# EAGLE design badge_scienceTour (EAGLE 6.5.0)
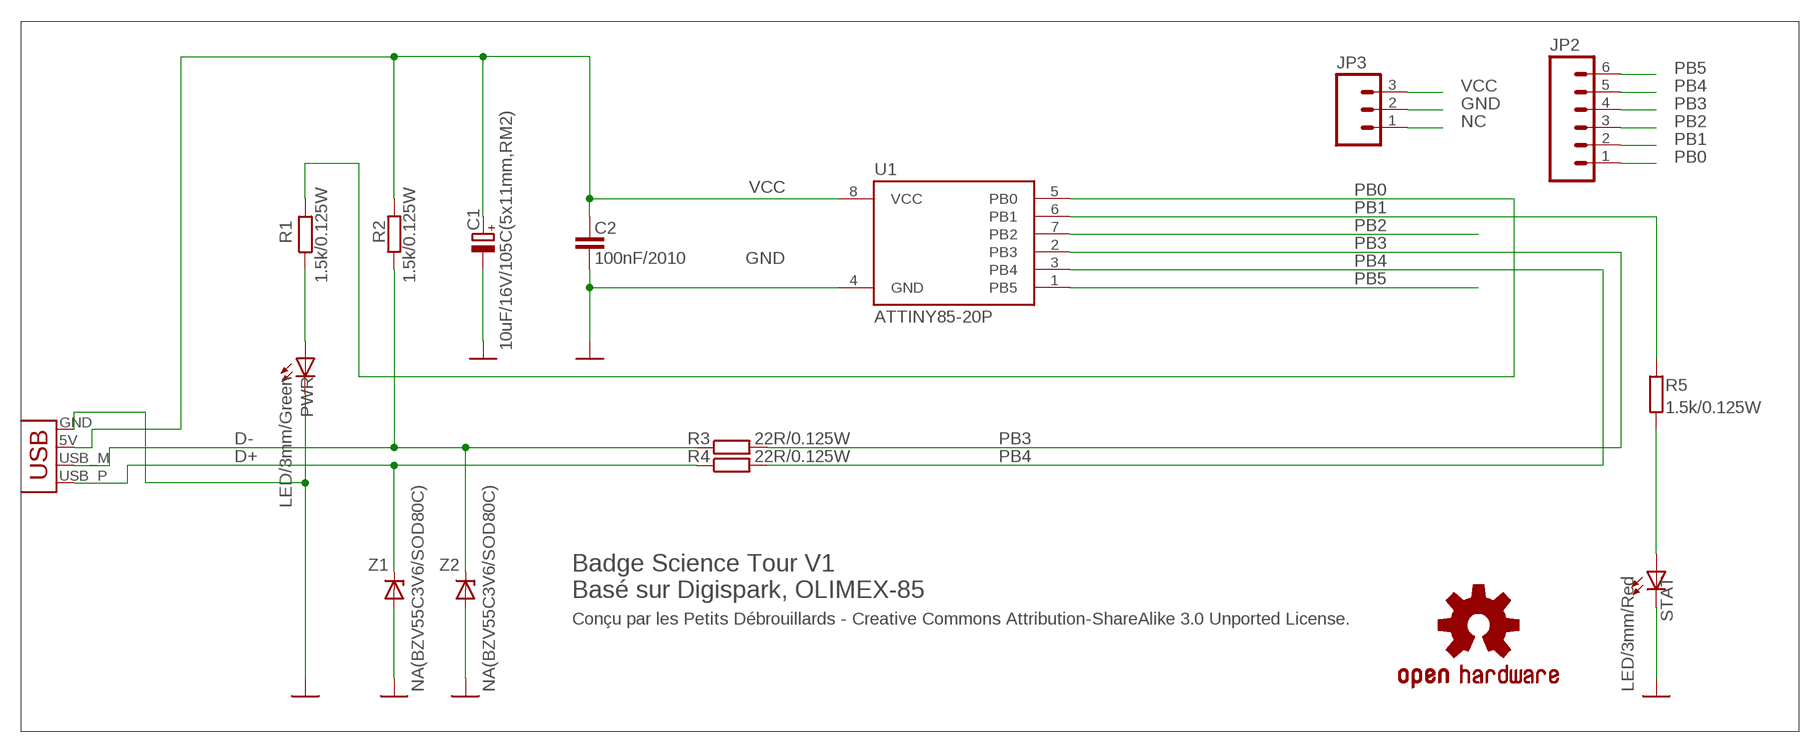
[diagram p0: schematic, sheet 1]

## Parts
C1  10uF/16V/105C(5x11mm,RM2)  CPOL-EUE2-5  [E2-5]
C2  100nF/2010  C-EU025-025X050  [C025-025X050]
JP1  USBPCB  [USB-A-PCB]
JP2  M06NO_SILK  [1X06_NO_SILK]
JP3  M031X03_NO_SILK  [1X03_NO_SILK]
LOGO1  OSHW-LOGOS  [OSHW-LOGO-S]
PWR  LED/3mm/Green  LED3MM  [LED3MM]
R1  1.5k/0.125W  R-EU_0204/5  [0204/5]
R2  1.5k/0.125W  R-EU_0204/5  [0204/5]
R3  22R/0.125W  R-EU_0204/5  [0204/5]
R4  22R/0.125W  R-EU_0204/5  [0204/5]
R5  1.5k/0.125W  R-EU_0204/5  [0204/5]
STAT  LED/3mm/Red  LED3MM  [LED3MM]
U1  ATTINY85-20P  [PDIP08_300MIL]
Z1  NA(BZV55C3V6/SOD80C)  ZENER-DIODEZD-5  [ZDIO-5]
Z2  NA(BZV55C3V6/SOD80C)  ZENER-DIODEZD-5  [ZDIO-5]

## Nets
D+: JP1.USB_P(D+) R4.1 Z1.C
D-: JP1.USB_M(D-) R2.1 R3.1 Z2.C
GND [PWR]: C1.- C2.2 JP1.GND JP3.2 PWR.K(C) STAT.K(C) U1.4(GND) Z1.A Z2.A
N$1: PWR.A R1.1
N$4: R5.1 STAT.A
NC: JP3.1
PB0: JP2.1 R1.2 U1.5(PB0)
PB1: JP2.2 R5.2 U1.6(PB1)
PB2: JP2.3 U1.7(PB2)
PB3: JP2.4 R3.2 U1.2(PB3)
PB4: JP2.5 R4.2 U1.3(PB4)
PB5: JP2.6 U1.1(PB5)
VCC [PWR]: C1.+ C2.1 JP1.5V(VBUS) JP3.3 R2.2 U1.8(VCC)

## Notes on the sheet
- Badge Science Tour V1
  Basé sur Digispark, OLIMEX-85
- Conçu par les Petits Débrouillards - Creative Commons Attribution-ShareAlike 3.0 Unported License.

## Library data of the parts
C1 = rcl:CPOL-EU: POLARIZED CAPACITOR, European symbol
C2 = rcl:C-EU: CAPACITOR, European symbol
JP1 = SparkFun-Connectors:USB: USB Connectors USB-B-PTH is fully proven SKU : PRT-00139/CONN-08278 USB-miniB is fully proven SKU : PRT-00587 USB-A-PCB is untested. USB-A-H is throughly reviewed, but untested. Spark Fun Electronics SKU : PRT-00437 USB-B-SMT is throughly reviewed, but untested. Needs silkscreen touching up. USB-A-S has not been used/tested USB-MB-H has not been used/tested USB-MICROB has been used. CONN-09505
JP2 = SparkFun-Connectors:M06: Header 6 Standard 6-pin 0.1" header. Use with straight break away headers (SKU : PRT-00116), right angle break away headers (PRT-00553), swiss pins (PRT-00743), machine pins (PRT-00117), and female headers (PRT-00115). Molex polarized connector foot print use with SKU : PRT-08094 with associated crimp pins and housings. NOTES ON THE VARIANTS LOCK and LOCK_LONGPADS... This footprint was designed to help hold the alignment of a through-hole component (i.e. 6-pin header) while soldering it into place. You may notice that each hole has been shifted either up or down by 0.005 of an inch from it's more standard position (which is a perfectly straight line). This slight alteration caused the pins (the squares in the middle) to touch the edges of the holes. Because they are alternating, it causes a "brace" to hold the component in place. 0.005 has proven to be the perfect amount of "off-center" position when using our standard breakaway headers. Although looks a little odd when you look at the bare footprint, once you have a header in there, the alteration is very hard to notice. Also,if you push a header all the way into place, it is covered up entirely on the bottom side. This idea of altering the position of holes to aid alignment will be further integrated into the Sparkfun Library for other footprints. It can help hold any component with 3 or more connection pins.
JP3 = SparkFun-Connectors:M03: Header 3 Standard 3-pin 0.1" header. Use with straight break away headers (SKU : PRT-00116), right angle break away headers (PRT-00553), swiss pins (PRT-00743), machine pins (PRT-00117), and female headers (PRT-00115). Molex polarized connector foot print use with SKU : PRT-08232 with associated crimp pins and housings.
LOGO1 = SparkFun-Aesthetics:OSHW-LOGO: Open Source Hardware Logo This logo indicates the piece of hardware it is found on incorporates a OSHW license and/or adheres to the definition of open source hardware found here: http://freedomdefined.org/OSHW
PWR STAT = led:LED: LED OSRAM: - CHIPLED LG R971, LG N971, LY N971, LG Q971, LY Q971, LO R971, LY R971 LH N974, LH R974 LS Q976, LO Q976, LY Q976 LO Q996 - Hyper CHIPLED LW Q18S LB Q993, LB Q99A, LB R99A - SideLED LS A670, LO A670, LY A670, LG A670, LP A670 LB A673, LV A673, LT A673, LW A673 LH A674 LY A675 LS A676, LA A676, LO A676, LY A676, LW A676 LS A679, LY A679, LG A679 - Hyper Micro SIDELED® LS Y876, LA Y876, LO Y876, LY Y876 LT Y87S - SmartLED LW L88C, LW L88S LB L89C, LB L89S, LG L890 LS L89K, LO L89K, LY L89K LS L896, LA L896, LO L896, LY L896 - TOPLED LS T670, LO T670, LY T670, LG T670, LP T670 LSG T670, LSP T670, LSY T670, LOP T670, LYG T670 LG T671, LOG T671, LSG T671 LB T673, LV T673, LT T673, LW T673 LH T674 LS T676, LA T676, LO T676, LY T676, LB T676, LH T676, LSB T676, LW T676 LB T67C, LV T67C, LT T67C, LS T67K, LO T67K, LY T67K, LW E67C LS E67B, LA E67B, LO E67B, LY E67B, LB E67C, LV E67C, LT E67C LW T67C LS T679, LY T679, LG T679 LS T770, LO T770, LY T770, LG T770, LP T770 LB T773, LV T773, LT T773, LW T773 LH T774 LS E675, LA E675, LY E675, LS T675 LS T776, LA T776, LO T776, LY T776, LB T776 LHGB T686 LT T68C, LB T68C - Hyper Mini TOPLED® LB M676 - Mini TOPLED Santana® LG M470 LS M47K, LO M47K, LY M47K Source: http://www.osram.convergy.de LUXEON: - LUMILED® LXK2-PW12-R00, LXK2-PW12-S00, LXK2-PW14-U00, LXK2-PW14-V00 LXK2-PM12-R00, LXK2-PM12-S00, LXK2-PM14-U00 LXK2-PE12-Q00, LXK2-PE12-R00, LXK2-PE12-S00, LXK2-PE14-T00, LXK2-PE14-U00 LXK2-PB12-K00, LXK2-PB12-L00, LXK2-PB12-M00, LXK2-PB14-N00, LXK2-PB14-P00, LXK2-PB14-Q00 LXK2-PR12-L00, LXK2-PR12-M00, LXK2-PR14-Q00, LXK2-PR14-R00 LXK2-PD12-Q00, LXK2-PD12-R00, LXK2-PD12-S00 LXK2-PH12-R00, LXK2-PH12-S00 LXK2-PL12-P00, LXK2-PL12-Q00, LXK2-PL12-R00 Source: www.luxeon.com KINGBRIGHT: KA-3528ASYC Source: www.kingbright.com
R1-R5 = rcl:R-EU_: RESISTOR, European symbol
U1 = _hhn_attiny25_45_85:ATTINY85*: ATMEL ATtiny 85 Packages: P = PDIP 08 30mil S = SOIC 08 EIAJ 208mil Technologies Note: for complete ordering code (temp. range, finish, tape&reel etc.) see www.atmel.com • Supply Voltage: V = (1.8…5.5)V | [blank] = (2.7…5.5)V • Speed: 10 = 10 MHz | 20 = 20 MHz Author: Dipl.-Ing. FH Rainer Bayer HHN Hochschule Heilbronn (Heilbronn University), rainer.bayer@hs-heilbronn.de Ingenieurbüro ing-rb, mail@ing-rb.de
Z1 Z2 = diode:ZENER-DIODE: Z-Diode

## Net classes
1 PWR: width 0.5 mm

## Board
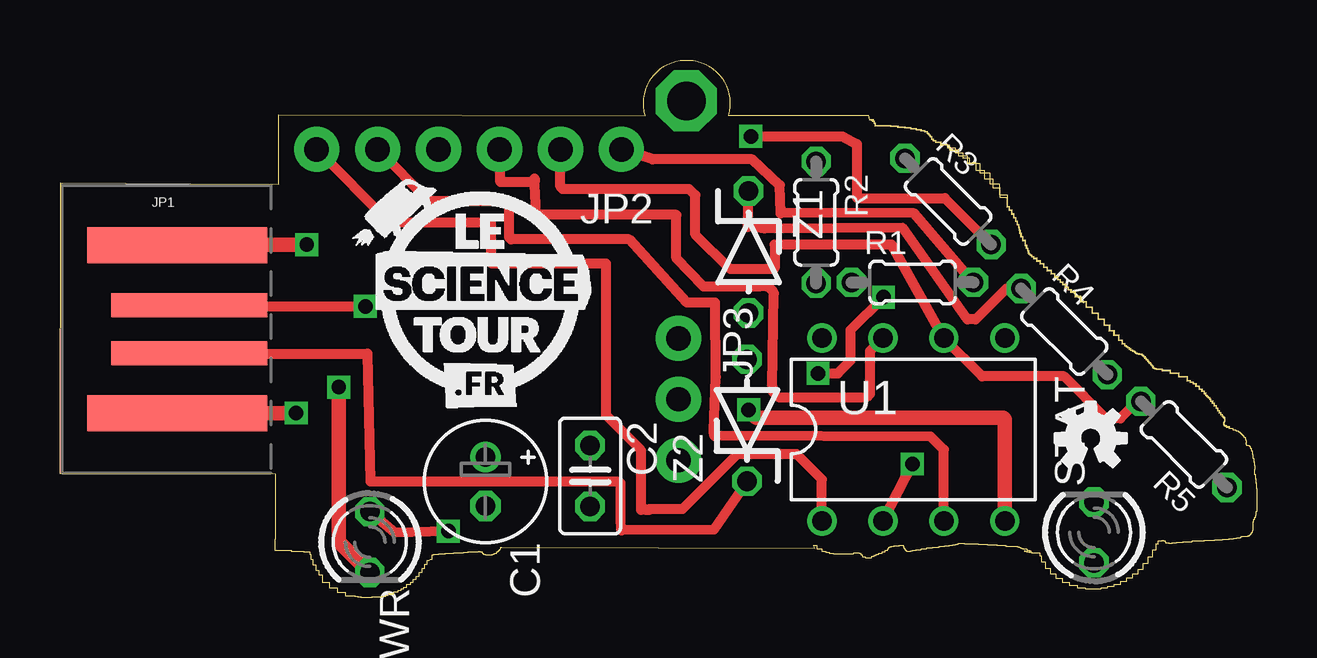
[diagram p1: board, top side]
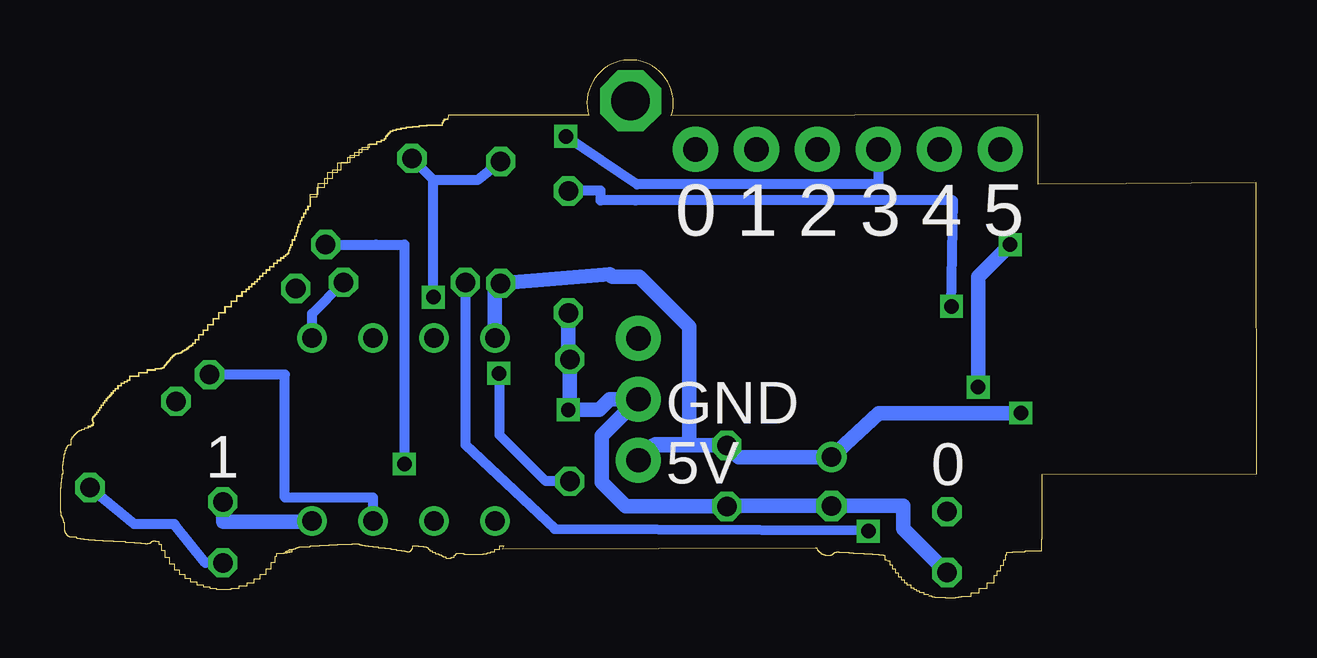
[diagram p2: board, bottom side, seen from below]

Size 49.87 x 22.4 mm. Coordinates in mm from the lower left corner, seen from the top.
Outline: 33.71,19.91 33.76,19.91 33.76,19.9 33.79,19.9 33.79,19.9 33.8,19.9 33.8,19.9 33.81,19.9 33.81,19.89 33.85,19.89 33.85,19.84 33.9,19.84 33.9,19.76 33.94,19.76 33.94,19.66 34.28,19.66 34.28,19.65 34.6,19.65 34.6,19.63 34.9,19.63 34.9,19.6 35.18,19.6 35.18,19.57 35.43,19.57 35.43,19.53 35.66,19.53 35.66,19.49 35.85,19.49 35.85,19.44 36.01,19.44 36.01,19.4 36.11,19.4 36.11,19.35 36.15,19.35 36.15,19.32 36.18,19.32 36.18,19.28 36.22,19.28 36.22,19.24 36.24,19.24 36.24,19.19 36.3,19.19 36.3,19.1 36.36,19.1 36.36,19.03 36.48,19.03 36.48,18.96 36.67,18.96 36.67,18.86 37.04,18.86 37.04,18.66 37.42,18.66 37.42,18.41 37.8,18.41 37.8,18.12 38.16,18.12 38.16,17.8 38.52,17.8 38.52,17.45 38.86,17.45 38.86,17.08 39.17,17.08 39.17,16.69 39.45,16.69 39.45,16.28 39.54,16.28 39.54,16.13 39.63,16.13 39.63,15.98 39.72,15.98 39.72,15.82 39.8,15.82 39.8,15.67 39.87,15.67 39.87,15.53 39.92,15.53 39.92,15.41 39.96,15.41 39.96,15.32 39.97,15.32 39.97,15.27 39.98,15.27 39.98,15.17 40.02,15.17 40.02,15.04 40.09,15.04 40.09,14.87 40.19,14.87 40.19,14.67 40.25,14.67 40.25,14.55 40.3,14.55 40.3,14.44 40.33,14.44 40.33,14.37 40.34,14.37 40.34,14.33 40.36,14.33 40.36,14.3 40.41,14.3 40.41,14.25 40.47,14.25 40.47,14.19 40.55,14.19 40.55,14.12 40.67,14.12 40.67,14.02 40.81,14.02 40.81,13.9 40.97,13.9 40.97,13.76 41.12,13.76 41.12,13.62 41.28,13.62 41.28,13.49 41.42,13.49 41.42,13.36 41.55,13.36 41.55,13.24 41.66,13.24 41.66,13.14 41.76,13.14 41.76,13.04 41.87,13.04 41.87,12.93 42,12.93 42,12.81 42.1,12.81 42.1,12.71 42.29,12.71 42.29,12.54 42.5,12.54 42.5,12.33 42.74,12.33 42.74,12.09 42.99,12.09 42.99,11.84 43.25,11.84 43.25,11.59 43.49,11.59 43.49,11.34 43.71,11.34 43.71,11.12 43.89,11.12 43.89,10.93 44.09,10.93 44.09,10.72 44.24,10.72 44.24,10.58 44.34,10.58 44.34,10.48 44.4,10.48 44.4,10.44 44.48,10.44 44.48,10.4 44.53,10.4 44.53,10.35 44.6,10.35 44.6,10.3 44.68,10.3 44.68,10.26 44.75,10.26 44.75,10.22 44.8,10.22 44.8,10.18 44.85,10.18 44.85,10.15 44.94,10.15 44.94,10.14 45,10.14 45,10.14 45.02,10.14 45.02,10.13 45.05,10.13 45.05,10.11 45.07,10.11 45.07,10.09 45.1,10.09 45.1,10.06 45.14,10.06 45.14,10.02 45.19,10.02 45.19,9.97 45.25,9.97 45.25,9.9 45.3,9.9 45.3,9.84 45.35,9.84 45.35,9.79 45.37,9.79 45.37,9.77 45.39,9.77 45.39,9.75 45.42,9.75 45.42,9.72 45.45,9.72 45.45,9.68 45.48,9.68 45.48,9.64 45.52,9.64 45.52,9.58 45.55,9.58 45.55,9.54 45.6,9.54 45.6,9.52 45.66,9.52 45.66,9.51 45.91,9.51 45.91,9.46 46.23,9.46 46.23,9.35 46.6,9.35 46.6,9.2 46.96,9.2 46.96,9.04 47.08,9.04 47.08,8.97 47.19,8.97 47.19,8.9 47.31,8.9 47.31,8.8 47.45,8.8 47.45,8.68 47.56,8.68 47.56,8.58 47.66,8.58 47.66,8.5 47.73,8.5 47.73,8.43 47.76,8.43 47.76,8.39 47.79,8.39 47.79,8.36 47.82,8.36 47.82,8.31 47.88,8.31 47.88,8.25 47.93,8.25 47.93,8.18 48,8.18 48,8.1 48.08,8.1 48.08,7.99 48.15,7.99 48.15,7.88 48.22,7.88 48.22,7.78 48.29,7.78 48.29,7.69 48.35,7.69 48.35,7.61 48.4,7.61 48.4,7.55 48.44,7.55 48.44,7.51 48.48,7.51 48.48,7.49 48.5,7.49 48.5,7.46 48.51,7.46 48.51,7.43 48.51,7.43 48.51,7.39 48.51,7.39 48.51,7.33 48.49,7.33 48.49,7.29 48.47,7.29 48.47,7.25 48.48,7.25 48.48,7.2 48.49,7.2 48.49,7.16 48.53,7.16 48.53,7.13 48.59,7.13 48.59,7.09 48.7,7.09 48.7,7.05 48.86,7.05 48.86,6.99 48.99,6.99 48.99,6.94 49.08,6.94 49.08,6.9 49.15,6.9 49.15,6.86 49.2,6.86 49.2,6.83 49.24,6.83 49.24,6.79 49.28,6.79 49.28,6.74 49.32,6.74 49.32,6.68 49.38,6.68 49.38,6.59 49.42,6.59 49.42,6.53 49.43,6.53 49.43,6.48 49.42,6.48 49.42,6.43 49.42,6.43 49.42,6.38 49.42,6.38 49.42,6.35 49.43,6.35 49.43,6.34 49.47,6.34 49.47,6.34 49.52,6.34 49.52,6.32 49.57,6.32 49.57,6.28 49.6,6.28 49.6,6.22 49.63,6.22 49.63,6.11 49.67,6.11 49.67,5.97 49.71,5.97 49.71,5.81 49.74,5.81 49.74,5.65 49.76,5.65 49.76,5.5 49.78,5.5 49.78,5.32 49.76,5.32 49.76,5.13 49.79,5.13 49.79,4.94 49.83,4.94 49.83,4.78 49.85,4.78 49.85,4.56 49.87,4.56 49.87,4.3 49.87,4.3 49.87,4.04 49.87,4.04 49.87,3.79 49.86,3.79 49.86,3.57 49.83,3.57 49.83,3.4 49.8,3.4 49.8,3.32 49.76,3.32 49.76,3.25 49.73,3.25 49.73,3.13 49.7,3.13 49.7,3 49.69,3 49.69,2.86 49.69,2.86 49.69,2.77 49.68,2.77 49.68,2.71 49.66,2.71 49.66,2.67 49.62,2.67 49.62,2.62 49.57,2.62 49.57,2.58 49.53,2.58 49.53,2.55 49.48,2.55 49.48,2.54 49.41,2.54 49.41,2.54 49.3,2.54 49.3,2.52 49.2,2.52 49.2,2.49 49.17,2.49 49.17,2.48 49.11,2.48 49.11,2.46 49.02,2.46 49.02,2.45 48.88,2.45 48.88,2.43 48.69,2.43 48.69,2.42 48.43,2.42 48.43,2.39 48.09,2.39 48.09,2.37 47.66,2.37 47.66,2.34 47.16,2.34 47.16,2.3 46.78,2.3 46.78,2.27 46.51,2.27 46.51,2.25 46.33,2.25 46.33,2.25 46.21,2.25 46.21,2.25 46.14,2.25 46.14,2.26 46.1,2.26 46.1,2.29 46.08,2.29 46.08,2.32 46.06,2.32 46.06,2.34 46.03,2.34 46.03,2.35 45.98,2.35 45.98,2.36 45.91,2.36 45.91,2.35 45.78,2.35 45.78,2.34 45.75,2.34 45.75,2.22 45.66,2.22 45.66,1.97 45.51,1.97 45.51,1.68 45.32,1.68 45.32,1.4 45.12,1.4 45.12,1.16 44.91,1.16 44.91,0.97 44.68,0.97 44.68,0.8 44.44,0.8 44.44,0.65 44.18,0.65 44.18,0.54 43.91,0.54 43.91,0.44 43.64,0.44 43.64,0.38 43.36,0.38 43.36,0.35 42.74,0.35 42.74,0.39 42.4,0.39 42.4,0.48 42.08,0.48 42.08,0.61 41.77,0.61 41.77,0.78 41.52,0.78 41.52,0.97 41.28,0.97 41.28,1.21 41.06,1.21 41.06,1.47 40.9,1.47 40.9,1.73 40.84,1.73 40.84,1.85 40.52,1.85 40.52,1.86 40.41,1.86 40.41,1.88 40.31,1.88 40.31,1.92 40.19,1.92 40.19,1.98 40.47,1.88 40.47,1.92 40.41,1.92 40.41,1.95 40.33,1.95 40.33,1.96 40.31,1.99 40.31,2 40.21,2 40.21,2.01 40.14,2.01 40.14,2.02 40.09,2.02 40.09,2.04 40.06,2.04 40.06,2.06 40.03,2.06 40.03,2.08 39.97,2.08 39.97,2.1 39.9,2.1 39.9,2.11 39.8,2.11 39.8,2.12 39.44,2.12 39.44,2.15 39.05,2.15 39.05,2.18 38.66,2.18 38.66,2.2 38.29,2.2 38.29,2.22 37.96,2.22 37.96,2.23 37.69,2.23 37.69,2.23 37.51,2.23 37.51,2.23 37.43,2.23 37.43,2.22 37.39,2.22 37.39,2.2 37.3,2.2 37.3,2.18 37.18,2.18 37.18,2.16 37.03,2.16 37.03,2.14 36.85,2.14 36.85,2.12 36.61,2.12 36.61,2.08 36.34,2.08 36.34,2.04 36.09,2.04 36.09,2.01 35.86,2.01 35.86,1.98 35.65,1.98 35.65,1.95 35.5,1.95 35.5,1.92 35.42,1.92 35.42,1.91 35.37,1.91 35.37,1.91 35.33,1.91 35.33,1.92 35.3,1.92 35.3,1.93 35.26,1.93 35.26,1.97 35.21,1.97 35.21,2.03 35.18,2.03 35.18,2.09 35.17,2.09 35.17,2.15 34.94,2.15 34.94,2.13 34.74,2.13 34.74,2.12 34.62,2.12 34.62,2.1 34.56,2.1 34.56,2.07 34.52,2.07 34.52,2.02 34.46,2.02 34.46,1.96 34.37,1.96 34.37,1.89 34.24,1.89 34.24,1.83 34.1,1.83 34.1,1.77 33.99,1.77 33.99,1.73 33.92,1.73 33.92,1.69 33.8,1.69 33.8,1.64 33.68,1.64 33.68,1.63 33.57,1.63 33.57,1.67 33.44,1.67 33.44,1.76 33.38,1.76 33.38,1.82 33.33,1.82 33.33,1.84 33.29,1.84 33.29,1.85 33.24,1.85 33.24,1.83 33.05,1.83 33.05,1.81 32.77,1.81 32.77,1.8 32.48,1.8 32.48,1.8 32.24,1.8 32.24,1.82 32.07,1.82 32.07,1.86 31.92,1.86 31.92,1.91 31.76,1.91 31.76,2.01 31.55,2.01 31.55,2.15 31.39,2.15 31.45,2.04 18.41,2.07 18.38,2.07 18.35,2.07 18.31,1.98 18.28,1.98 18.28,1.92 18.24,1.92 18.24,1.88 18.17,1.88 18.17,1.83 18.1,1.83 18.1,1.8 18.04,1.8 18.04,1.77 17.99,1.77 17.99,1.76 17.93,1.76 17.93,1.76 17.82,1.76 17.82,1.76 17.73,1.76 17.73,1.78 17.66,1.78 17.66,1.81 17.62,1.81 17.62,1.85 17.61,1.85 17.61,1.87 17.59,1.87 17.59,1.88 17.55,1.88 17.55,1.89 17.5,1.89 17.5,1.9 17.43,1.9 17.43,1.9 17.32,1.9 17.32,1.89 17.18,1.89 17.18,1.88 17,1.88 17,1.86 16.81,1.86 16.81,1.85 16.6,1.85 16.6,1.83 16.39,1.83 16.39,1.82 16.2,1.82 16.2,1.81 16.04,1.81 16.04,1.81 15.89,1.81 15.89,1.8 15.76,1.8 15.76,1.79 15.68,1.79 15.68,1.78 15.56,1.78 15.56,1.77 15.5,1.77 15.5,1.58 15.44,1.58 15.37,1.52 15.29,1.52 15.29,1.36 15.19,1.36 15.19,1.2 15.07,1.2 15.07,1.03 14.95,1.03 14.95,0.87 14.83,0.87 14.83,0.73 14.7,0.73 14.7,0.61 14.58,0.61 14.58,0.52 14.42,0.52 14.42,0.41 14.3,0.41 14.3,0.33 14.19,0.33 14.19,0.27 14.08,0.27 14.08,0.22 13.88,0.22 13.88,0.14 13.68,0.14
Outline: 13.68,0.06 13.55,0.06 13.55,0.03 13.42,0.03
Outline: 13.42,0.01 13.26,0.01 13.26,0 12.99,0 12.99,0 12.56,0 12.56,0.01 12.43,0.01 12.43,0.03 12.29,0.03 12.29,0.06 11.91,0.06 11.91,0.2 11.56,0.2 11.56,0.38 11.25,0.38 11.25,0.62 10.94,0.62 10.94,0.93 10.81,0.93 10.81,1.11 10.67,1.11 10.67,1.33 10.55,1.33 10.55,1.57 10.47,1.57 10.47,1.77 10.43,1.77 10.43,1.89 10.17,1.89 10.17,1.91 9.65,1.91 9.65,1.94 9.21,1.94
Outline: 33.74,19.93 33.74,19.93 33.78,19.93 33.78,19.93 33.81,19.93 33.81,19.93 33.83,19.93 33.83,19.92 33.84,19.92 33.84,19.92 33.88,19.92 33.88,19.86 33.92,19.86 33.92,19.78 33.96,19.78 33.96,19.68 34.3,19.68 34.3,19.67 34.62,19.67 34.62,19.65 34.92,19.65 34.92,19.62 35.2,19.62 35.2,19.59 35.46,19.59 35.46,19.55 35.69,19.55 35.69,19.51 35.88,19.51 35.88,19.47 36.03,19.47 36.03,19.42 36.14,19.42 36.14,19.37 36.17,19.37 36.17,19.34 36.21,19.34 36.21,19.31 36.24,19.31 36.24,19.26 36.27,19.26 36.27,19.21 36.32,19.21 36.32,19.12 36.39,19.12 36.39,19.05 36.5,19.05 36.5,18.98 36.69,18.98 36.69,18.89 36.98,18.89 36.98,18.73 37.29,18.73 37.29,18.53 37.61,18.53 37.61,18.31 37.9,18.31 37.9,18.09 38.33,18.09 38.33,17.69 38.75,17.69 38.75,17.25 39.13,17.25 39.13,16.78 39.47,16.78 39.47,16.3 39.56,16.3 39.56,16.16 39.65,16.16 39.65,16 39.74,16 39.74,15.85 39.82,15.85 39.82,15.69 39.89,15.69 39.89,15.55 39.94,15.55 39.94,15.44 39.98,15.44 39.98,15.35 39.99,15.35 39.99,15.29 40,15.29 40,15.19 40.04,15.19 40.04,15.06 40.11,15.06 40.11,14.9 40.22,14.9 40.22,14.69 40.27,14.69 40.27,14.57 40.32,14.57 40.32,14.47 40.36,14.47 40.36,14.39 40.37,14.39 40.37,14.35 40.39,14.35 40.39,14.33 40.43,14.33 40.43,14.28 40.49,14.28 40.49,14.22 40.57,14.22 40.57,14.15 40.7,14.15 40.7,14.04 40.84,14.04 40.84,13.92 40.99,13.92 40.99,13.79 41.15,13.79 41.15,13.65 41.3,13.65 41.3,13.51 41.44,13.51 41.44,13.38 41.57,13.38 41.57,13.26 41.68,13.26 41.68,13.16 41.78,13.16 41.78,13.06 41.9,13.06 41.9,12.95 42.02,12.95 42.02,12.84 42.13,12.84 42.13,12.74 42.31,12.74 42.31,12.56 42.53,12.56 42.53,12.35 42.77,12.35 42.77,12.12 43.02,12.12 43.02,11.87 43.27,11.87 43.27,11.61 43.51,11.61 43.51,11.37 43.73,11.37 43.73,11.14 43.92,11.14 43.92,10.95 44.11,10.95 44.11,10.75 44.26,10.75 44.26,10.6 44.36,10.6 44.36,10.5 44.43,10.5 44.43,10.46 44.5,10.46 44.5,10.42 44.56,10.42 44.56,10.38 44.62,10.38 44.62,10.33 44.7,10.33 44.7,10.28 44.78,10.28 44.78,10.24 44.83,10.24 44.83,10.2 44.88,10.2 44.88,10.17 44.96,10.17 44.96,10.16 45.02,10.16 45.02,10.16 45.05,10.16 45.05,10.15 45.07,10.15 45.07,10.14 45.1,10.14 45.1,10.12 45.13,10.12 45.13,10.09 45.16,10.09 45.16,10.05 45.21,10.05 45.21,9.99 45.27,9.99 45.27,9.92 45.33,9.92 45.33,9.86 45.37,9.86 45.37,9.82 45.4,9.82 45.4,9.79 45.42,9.79 45.42,9.77 45.44,9.77 45.44,9.74 45.47,9.74 45.47,9.7 45.5,9.7 45.5,9.66 45.54,9.66 45.54,9.6 45.58,9.6 45.58,9.57 45.62,9.57 45.62,9.55 45.68,9.55 45.68,9.54 45.93,9.54 45.93,9.48 46.26,9.48 46.26,9.37 46.62,9.37 46.62,9.22 46.98,9.22 46.98,9.06 47.1,9.06 47.1,8.99 47.21,8.99 47.21,8.92 47.34,8.92 47.34,8.83 47.48,8.83 47.48,8.71 47.59,8.71 47.59,8.61 47.68,8.61 47.68,8.52 47.75,8.52 47.75,8.46 47.79,8.46 47.79,8.42 47.81,8.42 47.81,8.39 47.85,8.39 47.85,8.34 47.9,8.34 47.9,8.27 47.96,8.27 47.96,8.2 48.02,8.2 48.02,8.12 48.1,8.12 48.1,8.02 48.18,8.02 48.18,7.91 48.24,7.91 48.24,7.81 48.31,7.81 48.31,7.72 48.37,7.72 48.37,7.63 48.43,7.63 48.43,7.57 48.47,7.57 48.47,7.54 48.5,7.54 48.5,7.51 48.52,7.51 48.52,7.49 48.54,7.49 48.54,7.45 48.54,7.45 48.54,7.39 48.53,7.39 48.53,7.31 48.51,7.31 48.51,7.27 48.49,7.27 48.49,7.22 48.52,7.22 48.52,7.18 48.6,7.18 48.6,7.13 48.72,7.13 48.72,7.07
Outline: 9.2,1.94 8.96,1.94 8.96,2.43 8.96,5.14 0,5.16 0.02,17.27 5.44,17.25 9.11,17.22 9.11,20.1 24.39,20.08 arc-213 27.84,20.09 33.68,20.09 33.72,19.91
Copper layers (1*16): Top 0.0356mm / dielectric 1.5011mm / Bottom 0.0356mm
Design rules "oshpark": minimum track width 6mil, minimum drill 13mil, track to track 6mil, track to pad 6mil, pad to pad 6mil, via to via 6mil, smd to smd 6mil, copper to edge 15mil, drill to drill 6mil, minimum pad ring 7mil, minimum via ring 7mil, stop-mask expansion 3mil, vias tented up to drill 0mil, thermal gap 10mil

### Footprints (pad centres in the part's own frame; a part is rotated, then mirrored left to right if it is on the bottom)
E2-5 = drill 0.813 pad 1.27: + -1.016,0 | drill 0.813 pad 1.27 octagon: - 1.016,0
C025-025X050 = drill 0.813 octagon: 1 -1.27,0; 2 1.27,0
USB-A-PCB = smd 7.5 x 1.5: 5V -0.2,-3.5; GND -0.2,3.5 | smd 6.5 x 1: USB_M 0.3,-1; USB_P 0.3,1
1X06_NO_SILK = drill 1.016 pad 1.88: 1 0,0; 2 2.54,0; 3 5.08,0; 4 7.62,0; 5 10.16,0; 6 12.7,0
1X03_NO_SILK = drill 1.016 pad 1.88: 1 0,0; 2 2.54,0; 3 5.08,0
LED3MM = drill 0.813 octagon: A -1.27,0; K 1.27,0
0204/5 = drill 0.813 octagon: 1 -2.54,0; 2 2.54,0
PDIP08_300MIL = drill 0.813: 1 -3.81,-3.81; 2 -1.27,-3.81; 3 1.27,-3.81; 4 3.81,-3.81; 5 3.81,3.81; 6 1.27,3.81; 7 -1.27,3.81; 8 -3.81,3.81
ZDIO-5 = drill 0.813 octagon: A 2.54,0; C -2.54,0

### Placement (x,y rotation side)
C1  17.73,4.83 270 top
C2  22.09,5.07 270 top
JP1  5.09,11.19 0 top
JP2  23.39,18.67 180 top
JP3  25.77,10.8 270 top
LOGO1  42.95,6.64 0 top
PWR  12.91,2.31 270 top
R1  35.52,13.13 0 top
R2  31.51,15.63 270 top
R3  37.01,16.5 315 top
R4  41.84,11.08 315 top
R5  46.83,6.38 135 top
STAT  43.08,2.71 90 top
U1  35.56,7 0 top
Z1  28.69,14.4 270 top
Z2  28.63,7.38 90 top

### Tracks (layer width: path | path; a pad name or v marks a point on that pad's centre or on a via)
D+  (via drill 0.6 pad 0.61)
  Top 0.406: R4.1 39.44,12.87 38.15,11.59 37.81,11.59 35.11,15.4 29.36,15.37 28.66,15.44 Z1.C | JP1.USB_P 5.44,12.13 v12.73,12.13
  Bottom 0.406: v12.73,12.13 12.66,16.54 15.75,16.56 25.9,16.54 27.34,16.54 27.34,16.96 Z1.C
D-  (via drill 0.6 pad 0.61)
  Top 0.406: Z2.C 27.25,2.83 23.39,2.8 23.36,3.31 23.36,4.77 23.2,4.83 12.95,4.83 12.82,10.16 12.79,10.13 8.15,10.13 8.1,10.19 JP1.USB_M | v31.58,9.34 32.41,9.34 32.95,9.88 32.95,11.15 v34.31,12.51
  Bottom 0.406: Z2.C 29.63,4.84 31.55,6.77 31.55,9.31 v31.58,9.34 | v34.31,12.51 34.31,17.4 | 34.31,17.4 R3.1 | 34.31,17.4 32.47,17.4 R2.1
GND  (via drill 0.6 pad 0.61)
  Top 0.61: v10.28,14.7 4.91,14.7 JP1.GND | v28.69,7.81 29.01,7.5 39.3,7.5 39.37,7.43 U1.4 | PWR.K 11.61,2.33 v11.61,8.77
  Bottom 0.61: v11.61,8.77 11.61,13.37 v10.28,14.7 | U1.4 39.37,3.15 43.07,3.15 STAT.K | Z1.A 28.69,9.99 Z2.A 28.63,7.88 v28.69,7.81 27.41,7.81 26.96,8.26 JP3.2 27.3,6.73 27.3,4.8 26.29,3.8 C2.2 22.07,3.82 C1.- 14.73,3.82 14.73,3.81 14.73,2.85 PWR.K
N$1  (via drill 0.6 pad 0.61)
  Top 0.406: v16.19,2.77 13.94,2.7 PWR.A
  Bottom 0.406: R1.1 32.98,6.36 29.27,2.86 16.38,2.8 v16.19,2.77
N$2  (via drill 1.6 pad 2.54)
  other vias: 26.1,20.69
N$4
  Bottom 0.406: STAT.A 43.81,1.44 45.11,3.05 46.78,3.05 R5.1
PB0
  Top 0.406: R1.2 35.6,16 30.73,16.04 30.03,16 30,17.18 28.85,18.26 24.69,18.26 JP2.1
  Bottom 0.406: U1.5 39.37,11.82 R1.2
PB1
  Top 0.406: R5.2 44.89,8.17 44.19,7.47 43.58,7.47 41.84,9.21 38.43,9.21 U1.6 34.65,14.7 30.6,14.7 29.77,14.7 29.77,13.72 29.74,13.69 27.93,13.69 26.47,15.12 26.47,16.77 26.22,17.02 20.95,17.02 20.85,17.12 JP2.2
PB2
  Top 0.406: U1.7 33.74,10.26 33.74,8.48 33.61,8.35 29.93,8.35 29.68,8.61 29.68,8.8 29.74,12.67 arc90 29.14,12.96 26.82,12.96 25.68,14.13 25.68,15.94 19.84,15.94 19.77,17.21 19.77,17.31 | 19.77,17.47 19.77,17.31 | 19.77,17.31 18.34,17.31 18.34,18.67 JP2.3
PB3  (via drill 0.6 pad 0.61)
  Top 0.406: v35.52,5.56 U1.2 | v28.79,19.21 30.28,19.21 30.88,19.21 32.6,19.21 33.2,18.89 33.2,16.64 36.87,16.64 R3.2
  Bottom 0.406: R3.2 36.7,14.71 35.52,14.7 v35.52,5.56 | JP2.4 15.77,17.21 25.84,17.21 v28.79,19.21
PB4
  Top 0.406: U1.3 36.83,6.16 36.28,6.7 27.27,6.74 27.23,6.93 27.27,6.99 27.23,6.96 27.33,9.18 27.3,12.29 26.12,12.29 23.71,14.93 18.79,14.93 18.73,14.99 18.73,16.51 15.39,16.51 JP2.5
  Bottom 0.406: U1.3 36.83,4.16 40.5,4.16 40.5,9.28 R4.2
PB5
  Top 0.406: U1.1 31.75,4.92 30.69,5.97 28.22,5.97 25.93,3.69 24.57,3.69 24.54,3.66 24.41,3.66 24.38,3.69 24.25,3.69 24.22,3.66 24.22,6.13 22.76,7.59 22.76,13.91 18,13.91 17.96,13.94 17.96,15.59 17.93,15.62 13.74,15.62 JP2.6
VCC  (via drill 0.6 pad 0.61)
  Top 0.61: v9.84,7.69 JP1.5V
  Bottom 0.61: v9.84,7.69 15.76,7.69 C1.+ 21.6,5.85 C2.1 25.16,6.34 JP3.3 25.74,5.72 25.07,6.39 23.65,6.39 23.65,11.27 25.74,13.37 26.85,13.37 26.95,13.47 R2.2 31.75,13.04 U1.8

### Text on the board
bPlace: 0 1 2 3 4 5 | 0 | GND / 5V | 1